# Altium schematic sheet BUFFER.SchDoc
size A4
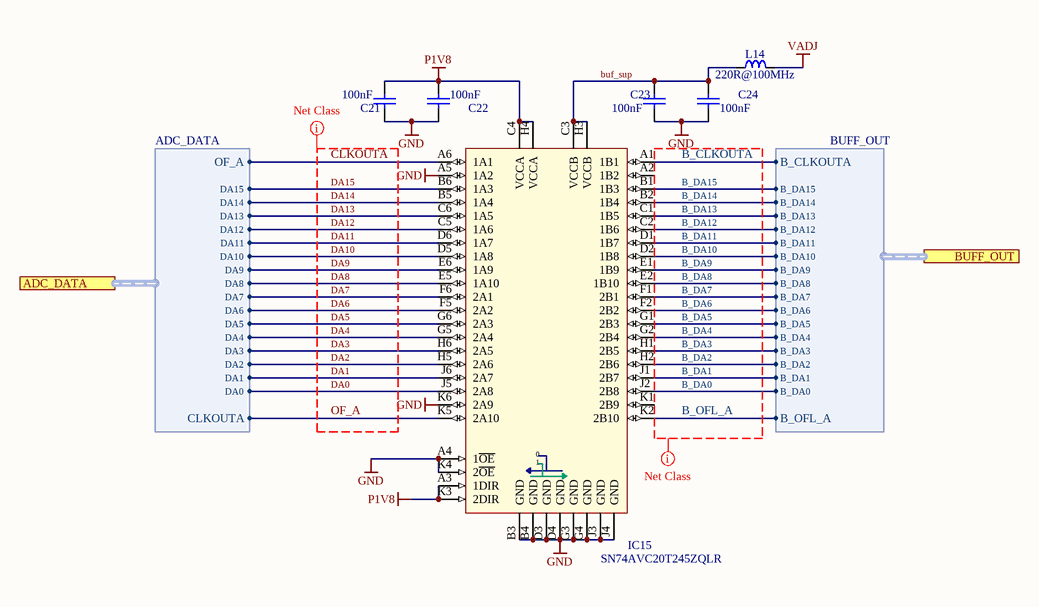
[diagram p0: BUFFER.SchDoc]

## Parts
C21  100nF  [CAPC0603X33N]
C22  100nF  [CAPC0603X33N]
C23  100nF  [CAPC0603X33N]
C24  100nF  [CAPC0603X33N]
IC15  SN74AVC20T245ZQLR  [ZQL56(R-PBGA-N56)]
L14  220R@100MHz  [INDC2012X105N]

## Ports
ADC_DATA (harness ADC_DATA), BUFF_OUT (harness BUFF_OUT)

## Harnesses
BUFF_OUT: B_CLKOUTA, B_OFL_A, B_DA15, B_DA14, B_DA13, B_DA12, B_DA11, B_DA10, B_DA9, B_DA8, B_DA7, B_DA6, B_DA5, B_DA4, B_DA3, B_DA2, B_DA1, B_DA0
ADC_DATA: CLKOUTA, OF_A, DA15, DA14, DA13, DA12, DA11, DA10, DA9, DA8, DA7, DA6, DA5, DA4, DA3, DA2, DA1, DA0

## Nets
GND: C21.1 C22.1 C23.1 C24.1 IC15.A4(1~{OE}) IC15.A5(1A2) IC15.B3(GND) IC15.B4(GND) IC15.D3(GND) IC15.D4(GND) IC15.G3(GND) IC15.G4(GND) IC15.J3(GND) IC15.J4(GND) IC15.K4(2~{OE}) IC15.K6(2A9)
P1V8: C21.2 C22.2 IC15.A3(1DIR) IC15.C4(VCCA) IC15.H4(VCCA) IC15.K3(2DIR)
VADJ: L14.2
B_CLKOUTA: IC15.A1(1B1) ; port BUFF_OUT.B_CLKOUTA
B_DA0: IC15.J2(2B8) ; port BUFF_OUT.B_DA0
B_DA1: IC15.J1(2B7) ; port BUFF_OUT.B_DA1
B_DA2: IC15.H2(2B6) ; port BUFF_OUT.B_DA2
B_DA3: IC15.H1(2B5) ; port BUFF_OUT.B_DA3
B_DA4: IC15.G2(2B4) ; port BUFF_OUT.B_DA4
B_DA5: IC15.G1(2B3) ; port BUFF_OUT.B_DA5
B_DA6: IC15.F2(2B2) ; port BUFF_OUT.B_DA6
B_DA7: IC15.F1(2B1) ; port BUFF_OUT.B_DA7
B_DA8: IC15.E2(1B10) ; port BUFF_OUT.B_DA8
B_DA9: IC15.E1(1B9) ; port BUFF_OUT.B_DA9
B_DA10: IC15.D2(1B8) ; port BUFF_OUT.B_DA10
B_DA11: IC15.D1(1B7) ; port BUFF_OUT.B_DA11
B_DA12: IC15.C2(1B6) ; port BUFF_OUT.B_DA12
B_DA13: IC15.C1(1B5) ; port BUFF_OUT.B_DA13
B_DA14: IC15.B2(1B4) ; port BUFF_OUT.B_DA14
B_DA15: IC15.B1(1B3) ; port BUFF_OUT.B_DA15
B_OFL_A: IC15.K2(2B10) ; port BUFF_OUT.B_OFL_A
buf_sup: C23.2 C24.2 IC15.C3(VCCB) IC15.H3(VCCB) L14.1
CLKOUTA: IC15.A6(1A1) ; port ADC_DATA.OF_A
DA0: IC15.J5(2A8) ; port ADC_DATA.DA0
DA1: IC15.J6(2A7) ; port ADC_DATA.DA1
DA2: IC15.H5(2A6) ; port ADC_DATA.DA2
DA3: IC15.H6(2A5) ; port ADC_DATA.DA3
DA4: IC15.G5(2A4) ; port ADC_DATA.DA4
DA5: IC15.G6(2A3) ; port ADC_DATA.DA5
DA6: IC15.F5(2A2) ; port ADC_DATA.DA6
DA7: IC15.F6(2A1) ; port ADC_DATA.DA7
DA8: IC15.E5(1A10) ; port ADC_DATA.DA8
DA9: IC15.E6(1A9) ; port ADC_DATA.DA9
DA10: IC15.D5(1A8) ; port ADC_DATA.DA10
DA11: IC15.D6(1A7) ; port ADC_DATA.DA11
DA12: IC15.C5(1A6) ; port ADC_DATA.DA12
DA13: IC15.C6(1A5) ; port ADC_DATA.DA13
DA14: IC15.B5(1A4) ; port ADC_DATA.DA14
DA15: IC15.B6(1A3) ; port ADC_DATA.DA15
OF_A: IC15.K5(2A10) ; port ADC_DATA.CLKOUTA

Not connected (* = marked no-connect by the designer): IC15 A2(1B2) K1(2B9)

## Layout directives
net class Buff_data: B_CLKOUTA, B_DA0, B_DA1, B_DA2, B_DA3, B_DA4, B_DA5, B_DA6, B_DA7, B_DA8, B_DA9, B_DA10, B_DA11, B_DA12, B_DA13, B_DA14, B_DA15, B_OFL_A
net class ADC_data: CLKOUTA, DA0, DA1, DA2, DA3, DA4, DA5, DA6, DA7, DA8, DA9, DA10, DA11, DA12, DA13, DA14, DA15, OF_A

## Notes on the sheet
- (in symbol 74AVC20T245) 0; 1

## Library data of the parts
C21-C24 = CC0201_100NF_6.3V_10%_X5R: Non-polarised capacitor; Part Description: SMD Multilayer Chip Ceramic Capacitor; Manufacturer: GENERIC; Manufacturer1 Part Number: 02016D104KAT2A; Voltage: 6.3V; TC: X5R; Tolerance: ±10%; Table: Capacitors SMD; Part Number: CC0201_100NF_6.3V_10%_X5R; Component Kind: Standard; Component Type: Standard; Pin Count: 2; Value: 100nF; Status: Not Recommended; Manufacturer Part Number: CC0201_100NF_6.3V_10%_X5R; Case: 0201; Mounted: Yes; Socket: No; SMD: Yes; Manufacturer1 Example: AVX; Manufacturer1 ComponentHeight: 0.33mm; HelpURL: \\cern.ch\dfs\Applications\Altium\Datasheets\CC0201_X5R_AVX.pdf; Author: CERN DEM JLC; CreateDate: 2007-12-03; LatestRevisionDate: 2007-12-03
IC15 = 74AVC20T245: 20-BIT DUAL SUPPLY BUS TRANSCEIVER; Supplier 1: Digi-Key; Supplier Part Number 1: 296-19097-1-ND; partnumber: SN74AVC20T245ZQLR
L14 = IND0805_MURATA_BLM21PG221SN1D: Inductor; Part Description: SMD EMIFIL Suppression Chip Ferrite Bead; Manufacturer: MURATA; Power: 2A; Resistance: 0.05R; Tolerance: ±25%; Table: Inductors SMD; Part Number: IND0805_MURATA_BLM21PG221SN1D; Component Kind: Standard; Component Type: Standard; Pin Count: 2; Value: 220R@100MHz; Status: None; Manufacturer Part Number: BLM21PG221SN1D; Case: 0805; Mounted: Yes; Socket: No; SMD: Yes; ComponentHeight: 1.05mm; HelpURL: \\cern.ch\dfs\Applications\Altium\Datasheets\IND0402_MURATA_BLM21P.pdf; Author: CERN DEM JLC; CreateDate: 25/1/2010; LatestRevisionDate: 25/1/2010